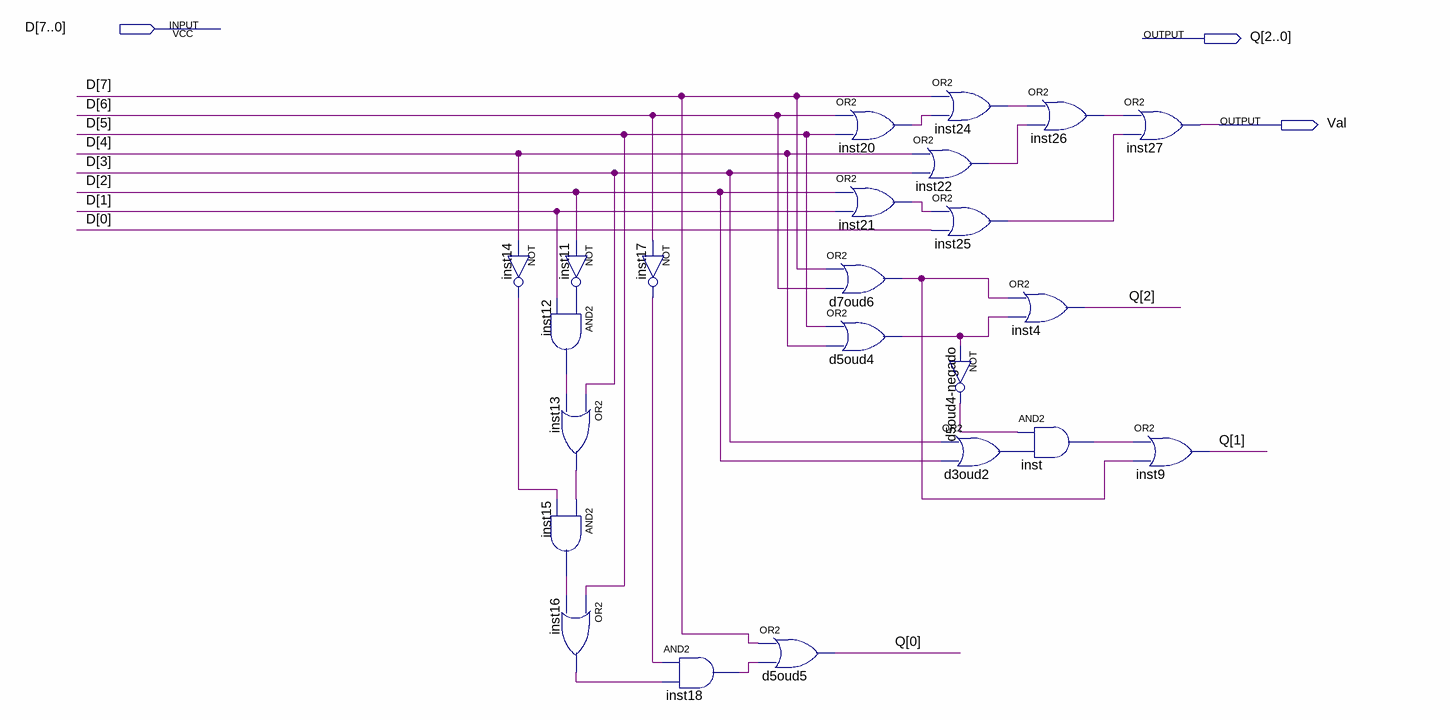
[diagram p0: schematic sheet]
// Quartus schematic encoder.bdf as structural Verilog: 23 symbols, 3 pins
module encoder (
  input  [7:0] D,
  output [2:0] Q,
  output Val
);

  wire d3oud2_out, d5oud4_negado_out, d5oud4_out, d7oud6_out, inst11_out, inst12_out, inst13_out, inst14_out,
       inst15_out, inst16_out, inst17_out, inst18_out, inst20_out, inst21_out, inst22_out, inst24_out,
       inst25_out, inst26_out, inst_out;

  not inst11 (inst11_out, D[2]);
  not inst14 (inst14_out, D[4]);
  and inst12 (inst12_out, inst11_out, D[1]);
  or inst13 (inst13_out, D[3], inst12_out);
  and inst15 (inst15_out, inst13_out, inst14_out);
  or inst16 (inst16_out, D[5], inst15_out);
  not inst17 (inst17_out, D[6]);
  and inst18 (inst18_out, inst17_out, inst16_out);
  or d5oud5 (Q[0], D[7], inst18_out);
  or inst20 (inst20_out, D[6], D[5]);
  or inst21 (inst21_out, D[2], D[1]);
  or d7oud6 (d7oud6_out, D[7], D[6]);
  or d5oud4 (d5oud4_out, D[5], D[4]);
  or inst24 (inst24_out, D[7], inst20_out);
  or inst22 (inst22_out, D[4], D[3]);
  or inst25 (inst25_out, inst21_out, D[0]);
  not \d5oud4-negado  (d5oud4_negado_out, d5oud4_out);
  or d3oud2 (d3oud2_out, D[3], D[2]);
  or inst26 (inst26_out, inst24_out, inst22_out);
  or inst4 (Q[2], d7oud6_out, d5oud4_out);
  and inst (inst_out, d5oud4_negado_out, d3oud2_out);
  or inst27 (Val, inst26_out, inst25_out);
  or inst9 (Q[1], inst_out, d7oud6_out);
endmodule
